# EAGLE schematic EEZ DIB MCU r3B4 (EAGLE 7.2.0)
SDcard socket updated
Assembly variants: Farnell, TME

## Sheet 1 of 5: I/O connectors, Encoder, user SW
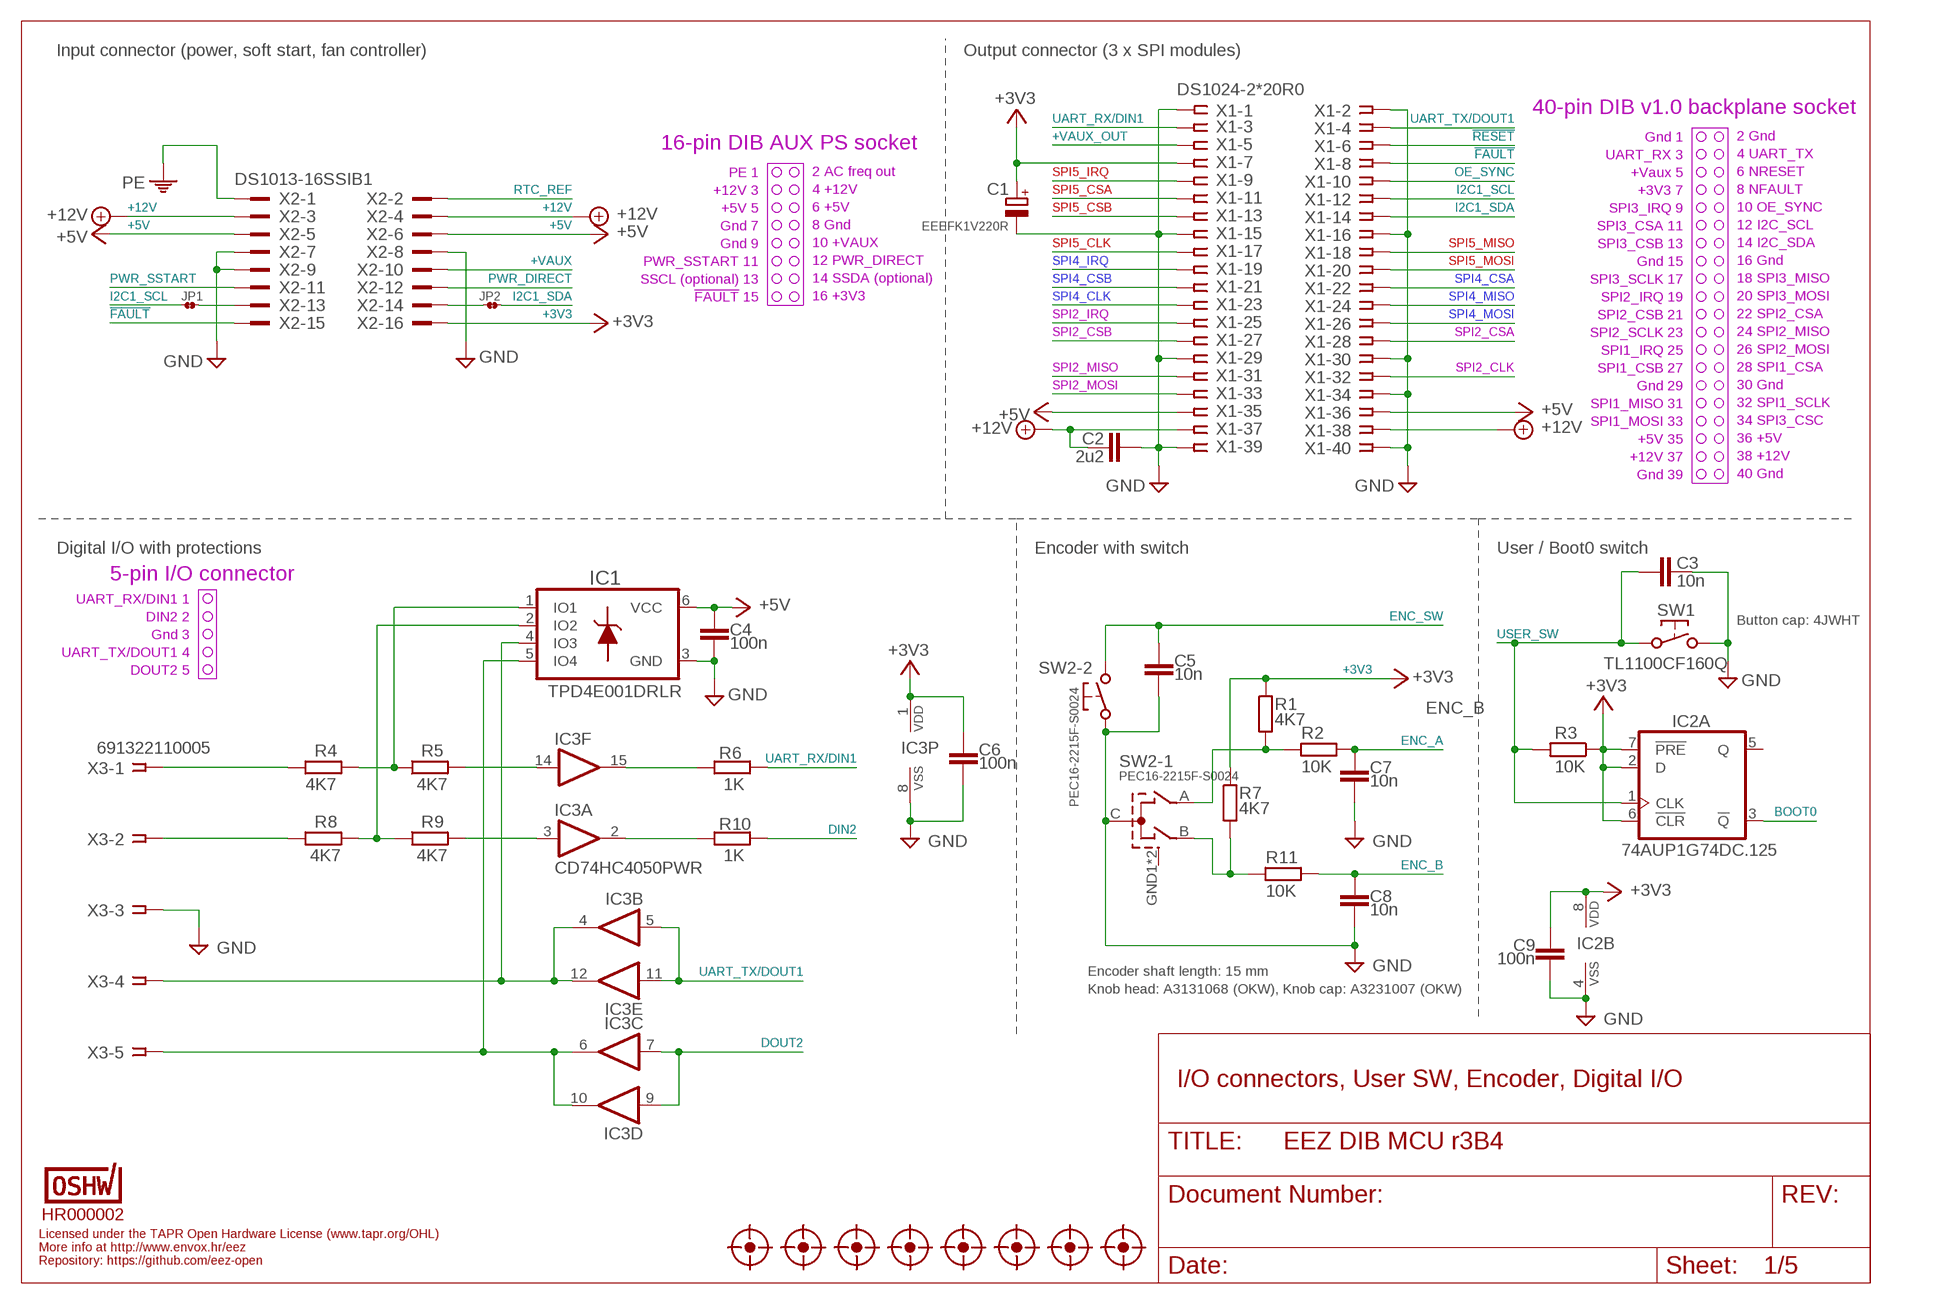
[diagram p0: schematic, sheet 1]

### Parts
C1  EEEFK1V220R  ECAPPANASONIC_C  [PANASONIC_C]
C2  2u2  C-EUC0805  [C0805]
C3  10n  C-EUC0805  [C0805]
C4  100n  C-EUC0603  [C0603]
C5  10n  C-EUC0805  [C0805]
C6  100n  C-EUC0603  [C0603]
C7  10n  C-EUC0805  [C0805]
C8  10n  C-EUC0805  [C0805]
C9  100n  C-EUC0603  [C0603]
FM1  FIDUCIAL  [FIDUCIAL]
FM2  FIDUCIAL  [FIDUCIAL]
FM3  FIDUCIAL  [FIDUCIAL]
FM4  FIDUCIAL  [FIDUCIAL]
FM5  FIDUCIAL  [FIDUCIAL]
FM6  FIDUCIAL  [FIDUCIAL]
FM7  FIDUCIAL  [FIDUCIAL]
FM8  FIDUCIAL  [FIDUCIAL]
IC1  TPD4E001DRLR  TPD4E001-DRL  [DRL6]
IC2  74AUP1G74DC.125  SN74LVC1G74DCTR-VSSOP  [DCU8]
IC3  CD74HC4050PWR  [PW16]
JP1  JP2-NOCUT  [JP2-NOCUT]
JP2  JP2-NOCUT  [JP2-NOCUT]
LABEL1  HR000002  OSHWA-CERT-SMALL  [CERT-SMALL-SILK]
R1  4K7  R-EU_R0805  [R0805]
R2  10K  R-EU_R0805  [R0805]
R3  10K  R-EU_R0805  [R0805]
R4  4K7  R-EU_R0805  [R0805]
R5  4K7  R-EU_R0805  [R0805]
R6  1K  R-EU_R0805  [R0805]
R7  4K7  R-EU_R0805  [R0805]
R8  4K7  R-EU_R0805  [R0805]
R9  4K7  R-EU_R0805  [R0805]
R10  1K  R-EU_R0805  [R0805]
R11  10K  R-EU_R0805  [R0805]
SW1  TL1100CF160Q  TL1100C  [TL1100C]
SW2  PEC16-2215F-S0024  ENCODER_SW-PEC16  [PEC16-2215F]
X1  DS1024-2*20R0  ZL263-40DG  [ZL263-40DG]
X2  DS1013-16SSIB1  IDC-16PIN  [IDC-16PIN]
X3  691322110005  MC1,5/5-G-3,5  [MC1,5/5-G-3,5]

### Nets
!FAULT: X1.8 X2.15 ; also sheet 2
!RESET: X1.6 ; also sheet 2,3,5
+3V3: C1.1(+) C6.1 C9.1 IC2.2(A:D) IC2.6(A:!CLR) IC2.7(A:!PRE) IC2.8(B:VDD) IC3.1(P:VDD) R1.1 R3.1 R7.1 X1.7 X2.16 ; also sheet 2,3,4,5
+5V: C4.1 IC1.6(VCC) X1.35 X1.36 X2.5 X2.6 ; also sheet 2,4
+12V: C2.1 X1.37 X1.38 X2.3 X2.4
+VAUX: X2.10 ; also sheet 2
+VAUX_OUT: X1.5 ; also sheet 2
BOOT0: IC2.3(A:!Q) ; also sheet 2
DIN2: R10.2 ; also sheet 2
DOUT2: IC3.7(C:I) IC3.9(D:I) ; also sheet 2
ENC_A: C7.2 R2.1 ; also sheet 2
ENC_B: C8.1 R11.1 ; also sheet 2
ENC_SW: C5.2 SW2.E ; also sheet 2
EOUT_A: R1.2 R2.2 SW2.A(-1:A)
EOUT_B: R7.2 R11.2 SW2.B(-1:B)
GND [gnd]: C1.2(-) C2.2 C3.1 C4.2 C5.1 C6.2 C7.1 C8.2 C9.2 IC1.3(GND) IC2.4(B:VSS) IC3.8(P:VSS) SW1.2 SW2.C(-1:C) SW2.D X1.1 X1.2 X1.15 X1.16 X1.29 X1.30 X1.34 X1.39 X1.40 X2.7 X2.8 X2.9 X3.3 ; also sheet 2,3,4,5
I2C1_SCL: JP1.1 X1.12 ; also sheet 2,3,4
I2C1_SDA: JP2.2 X1.14 ; also sheet 2,3,4
N$7: JP1.2 X2.13
N$13: JP2.1 X2.14
N$41: IC1.2(IO2) R8.2 R9.1
N$42: IC3.15(F:O) R6.1
N$43: IC3.2(A:O) R10.1
N$46: IC3.14(F:I) R5.2
N$47: IC3.3(A:I) R9.2
N$60: R4.1 X3.1
OE_SYNC: X1.10 ; also sheet 2
PE: X2.1 ; also sheet 4,5
PWR_DIRECT: X2.12 ; also sheet 2
PWR_SSTART: X2.11 ; also sheet 2
RTC_REF: X2.2 ; also sheet 2
SPI2_CLK: X1.32 ; also sheet 2
SPI2_CSA: X1.28 ; also sheet 2
SPI2_CSB: X1.27 ; also sheet 2
SPI2_IRQ: X1.25 ; also sheet 2
SPI2_MISO: X1.31 ; also sheet 2
SPI2_MOSI: X1.33 ; also sheet 2
SPI4_CLK: X1.23 ; also sheet 2
SPI4_CSA: X1.22 ; also sheet 2
SPI4_CSB: X1.21 ; also sheet 2
SPI4_IRQ: X1.19 ; also sheet 2
SPI4_MISO: X1.24 ; also sheet 2
SPI4_MOSI: X1.26 ; also sheet 2
SPI5_CLK: X1.17 ; also sheet 2
SPI5_CSA: X1.11 ; also sheet 2
SPI5_CSB: X1.13 ; also sheet 2
SPI5_IRQ: X1.9 ; also sheet 2
SPI5_MISO: X1.18 ; also sheet 2
SPI5_MOSI: X1.20 ; also sheet 2
UART_RX/DIN1: R6.2 X1.3 ; also sheet 2
UART_TX/DOUT1: IC3.5(B:I) IC3.11(E:I) X1.4 ; also sheet 2
USER_SW: C3.2 IC2.1(A:CLK) R3.2 SW1.1 ; also sheet 2
X_DIN1: IC1.1(IO1) R4.2 R5.1
X_DIN2: R8.1 X3.2
X_DOUT1: IC1.4(IO3) IC3.4(B:O) IC3.12(E:O) X3.4
X_DOUT2: IC1.5(IO4) IC3.6(C:O) IC3.10(D:O) X3.5
Unconnected: IC2.5(A:Q) SW2.GND1(-1:SH) SW2.GND2(-1:SH)

### Notes on the sheet
- Input connector (power, soft start, fan controller) | Output connector (3 x SPI modules)
- 40-pin DIB v1.0 backplane socket
- Gnd 1
- 2 Gnd
- 16-pin DIB AUX PS socket | UART_RX 3
- 4 UART_TX
- PE 1 | +Vaux 5
- 2 AC freq out | 6 NRESET
- +12V 3 | +3V3 7
- 4 +12V | 8 NFAULT
- +5V 5 | SPI3_IRQ 9
- 6 +5V | 10 OE_SYNC
- Gnd 7 | SPI3_CSA 11
- 8 Gnd | 12 I2C_SCL
- Gnd 9 | SPI3_CSB 13
- 10 +VAUX | 14 I2C_SDA
- PWR_SSTART 11 | Gnd 15
- 12 PWR_DIRECT | 16 Gnd
- SSCL (optional) 13 | SPI3_SCLK 17
- 14 SSDA (optional) | 18 SPI3_MISO
- !FAULT! 15 | SPI2_IRQ 19
- 16 +3V3 | 20 SPI3_MOSI
- SPI2_CSB 21
- 22 SPI2_CSA
- SPI2_SCLK 23
- 24 SPI2_MISO
- SPI1_IRQ 25
- 26 SPI2_MOSI
- SPI1_CSB 27
- 28 SPI1_CSA
- Gnd 29
- 30 Gnd
- SPI1_MISO 31
- 32 SPI1_SCLK
- SPI1_MOSI 33
- 34 SPI3_CSC
- +5V 35
- 36 +5V
- +12V 37
- 38 +12V
- Gnd 39
- 40 Gnd
- Digital I/O with protections | Encoder with switch | User / Boot0 switch
- 5-pin I/O connector
- UART_RX/DIN1 1
- DIN2 2
- Button cap: 4JWHT
- Gnd 3
- UART_TX/DOUT1 4
- DOUT2 5
- Encoder shaft length: 15 mm
- Knob head: A3131068 (OKW), Knob cap: A3231007 (OKW)
- I/O connectors, User SW, Encoder, Digital I/O
- Licensed under the TAPR Open Hardware License (www.tapr.org/OHL)
- More info at http://www.envox.hr/eez
- Repository: https://github.com/eez-open

## Sheet 2 of 5: STM32F7 MCU
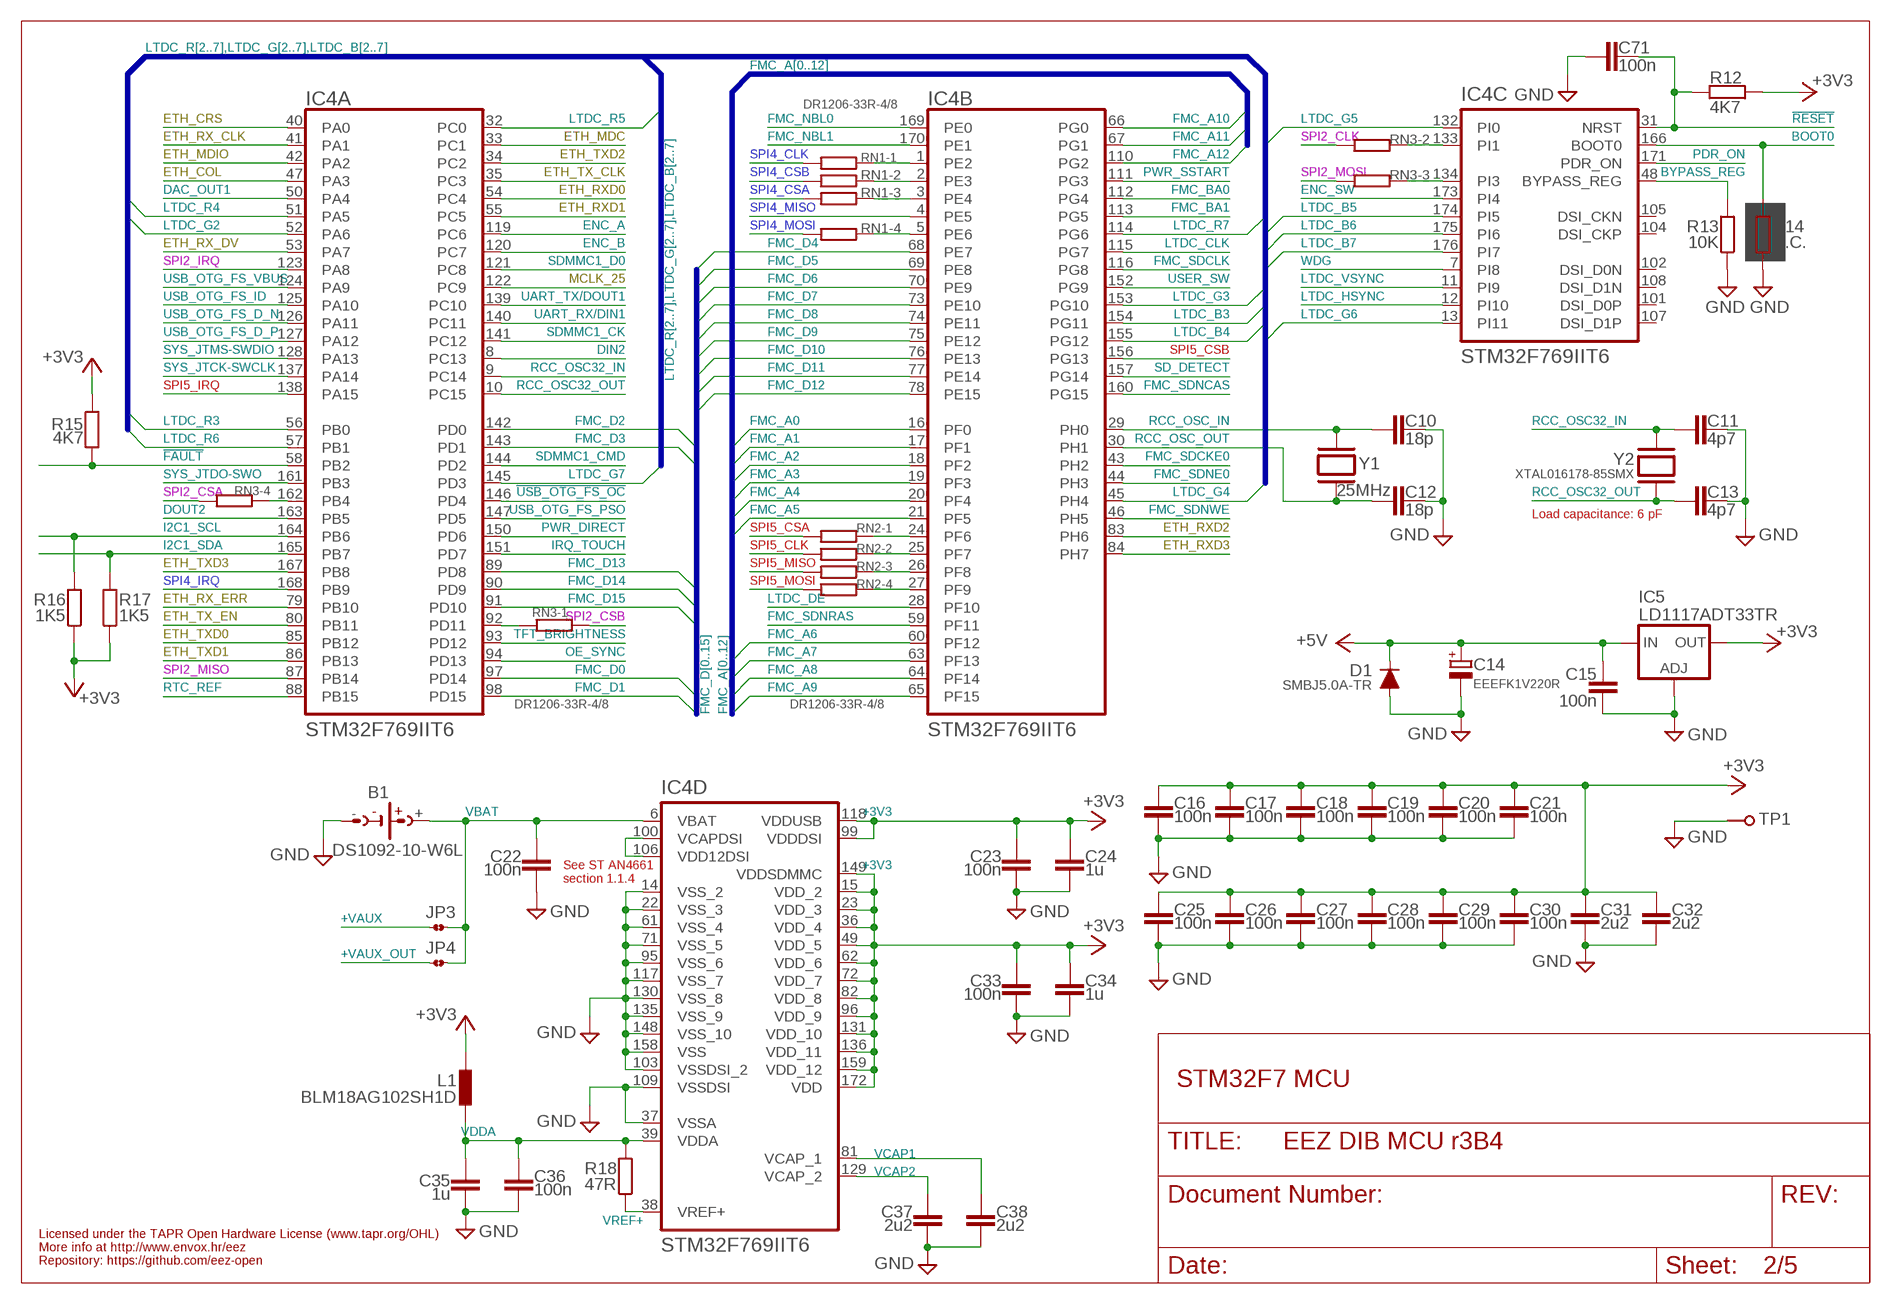
[diagram p1: schematic, sheet 2]

### Parts
B1  DS1092-10-W6L  CELL_BATTERY-SMT_HORIZ  [DS1092-10-W6L]
C10  18p  C-EUC0603  [C0603]
C11  4p7  C-EUC0603  [C0603]
C12  18p  C-EUC0603  [C0603]
C13  4p7  C-EUC0603  [C0603]
C14  EEEFK1V220R  ECAPPANASONIC_C  [PANASONIC_C]
C15  100n  C-EUC0603  [C0603]
C16  100n  C-EUC0603  [C0603]
C17  100n  C-EUC0603  [C0603]
C18  100n  C-EUC0603  [C0603]
C19  100n  C-EUC0603  [C0603]
C20  100n  C-EUC0603  [C0603]
C21  100n  C-EUC0603  [C0603]
C22  100n  C-EUC0603  [C0603]
C23  100n  C-EUC0603  [C0603]
C24  1u  C-EUC0805  [C0805]
C25  100n  C-EUC0603  [C0603]
C26  100n  C-EUC0603  [C0603]
C27  100n  C-EUC0603  [C0603]
C28  100n  C-EUC0603  [C0603]
C29  100n  C-EUC0603  [C0603]
C30  100n  C-EUC0603  [C0603]
C31  2u2  C-EUC0805  [C0805]
C32  2u2  C-EUC0805  [C0805]
C33  100n  C-EUC0603  [C0603]
C34  1u  C-EUC0805  [C0805]
C35  1u  C-EUC0805  [C0805]
C36  100n  C-EUC0603  [C0603]
C37  2u2  C-EUC0805  [C0805]
C38  2u2  C-EUC0805  [C0805]
C71  100n  C-EUC0603  [C0603]
D1  SMBJ5.0A-TR  DIODEDO214AA  [DO214AA]
IC4  STM32F769IIT6  STM32F769IXT  [LQFP-176_24X24MM]
IC5  LD1117ADT33TR  LD117ADT33TR  [DPACK]
JP3  JP2-CUT-0805  [R_0805]
JP4  JP2-CUT-0805  [R_0805]
L1  BLM18AG102SH1D  FERRITE_BEAD0603  [BEAD0603]
R12  4K7  R-EU_R0805  [R0805]
R13  10K  R-EU_R0805  [R0805]
R14  N.C.  R-EU_R0805  [R0805]
R15  4K7  R-EU_R0805  [R0805]
R16  1K5  R-EU_R0805  [R0805]
R17  1K5  R-EU_R0805  [R0805]
R18  47R  R-EU_R0805  [R0805]
RN1  DR1206-33R-4/8  R_ARRAY4  [CAY16]
RN2  DR1206-33R-4/8  R_ARRAY4  [CAY16]
RN3  DR1206-33R-4/8  R_ARRAY4  [CAY16]
TP1  PCB_TEST_TABSHIELD  [PCB_SHIELD_TAB]
Y1  25MHz  XTALSMD  [HC-49/4H]
Y2  XTAL016178-85SMX  XTAL85SMX  [85SMX]

### Nets
!FAULT: IC4.58(A:PB2) R15.2 ; also sheet 1
!RESET: C71.2 IC4.31(C:NRST) R12.2 ; also sheet 1,3,5
!USB_OTG_FS_OC: IC4.146(A:PD4) ; also sheet 4
+3V3: C16.1 C17.1 C18.1 C19.1 C20.1 C21.1 C23.1 C24.1 C25.1 C26.1 C27.1 C28.1 C29.1 C30.1 C31.1 C32.1 C33.1 C34.1 IC4.15(D:VDD_2) IC4.23(D:VDD_3) IC4.36(D:VDD_4) IC4.49(D:VDD_5) IC4.62(D:VDD_6) IC4.72(D:VDD_7) IC4.82(D:VDD_8) IC4.96(D:VDD_9) IC4.99(D:VDDDSI) IC4.118(D:VDDUSB) IC4.131(D:VDD_10) IC4.136(D:VDD_11) IC4.149(D:VDDSDMMC) IC4.159(D:VDD_12) IC4.172(D:VDD) IC5.4(OUT) L1.P$1 R12.1 R15.1 R16.1 R17.1 ; also sheet 1,3,4,5
+5V: C14.1(+) C15.1 D1.C IC5.3(IN) ; also sheet 1,4
+VAUX: JP3.2 ; also sheet 1
+VAUX_OUT: JP4.2 ; also sheet 1
BOOT0: IC4.166(C:BOOT0) R14.2 ; also sheet 1
BYPASS_REG: IC4.48(C:BYPASS_REG) R13.2
DAC_OUT1: IC4.50(A:PA4) ; also sheet 4
DIN2: IC4.8(A:PC13) ; also sheet 1
DOUT2: IC4.163(A:PB5) ; also sheet 1
ENC_A: IC4.119(A:PC6) ; also sheet 1
ENC_B: IC4.120(A:PC7) ; also sheet 1
ENC_SW: IC4.173(C:PI4) ; also sheet 1
ETH_COL: IC4.47(A:PA3) ; also sheet 5
ETH_CRS: IC4.40(A:PA0) ; also sheet 5
ETH_MDC: IC4.33(A:PC1) ; also sheet 5
ETH_MDIO: IC4.42(A:PA2) ; also sheet 5
ETH_RX_CLK: IC4.41(A:PA1) ; also sheet 5
ETH_RX_DV: IC4.53(A:PA7) ; also sheet 5
ETH_RX_ERR: IC4.79(A:PB10) ; also sheet 5
ETH_RXD0: IC4.54(A:PC4) ; also sheet 5
ETH_RXD1: IC4.55(A:PC5) ; also sheet 5
ETH_RXD2: IC4.83(B:PH6) ; also sheet 5
ETH_RXD3: IC4.84(B:PH7) ; also sheet 5
ETH_TX_CLK: IC4.35(A:PC3) ; also sheet 5
ETH_TX_EN: IC4.80(A:PB11) ; also sheet 5
ETH_TXD0: IC4.85(A:PB12) ; also sheet 5
ETH_TXD1: IC4.86(A:PB13) ; also sheet 5
ETH_TXD2: IC4.34(A:PC2) ; also sheet 5
ETH_TXD3: IC4.167(A:PB8) ; also sheet 5
FMC_A0: IC4.16(B:PF0) ; also sheet 3
FMC_A1: IC4.17(B:PF1) ; also sheet 3
FMC_A2: IC4.18(B:PF2) ; also sheet 3
FMC_A3: IC4.19(B:PF3) ; also sheet 3
FMC_A4: IC4.20(B:PF4) ; also sheet 3
FMC_A5: IC4.21(B:PF5) ; also sheet 3
FMC_A6: IC4.60(B:PF12) ; also sheet 3
FMC_A7: IC4.63(B:PF13) ; also sheet 3
FMC_A8: IC4.64(B:PF14) ; also sheet 3
FMC_A9: IC4.65(B:PF15) ; also sheet 3
FMC_A10: IC4.66(B:PG0) ; also sheet 3
FMC_A11: IC4.67(B:PG1) ; also sheet 3
FMC_A12: IC4.110(B:PG2) ; also sheet 3
FMC_BA0: IC4.112(B:PG4) ; also sheet 3
FMC_BA1: IC4.113(B:PG5) ; also sheet 3
FMC_D0: IC4.97(A:PD14) ; also sheet 3
FMC_D1: IC4.98(A:PD15) ; also sheet 3
FMC_D2: IC4.142(A:PD0) ; also sheet 3
FMC_D3: IC4.143(A:PD1) ; also sheet 3
FMC_D4: IC4.68(B:PE7) ; also sheet 3
FMC_D5: IC4.69(B:PE8) ; also sheet 3
FMC_D6: IC4.70(B:PE9) ; also sheet 3
FMC_D7: IC4.73(B:PE10) ; also sheet 3
FMC_D8: IC4.74(B:PE11) ; also sheet 3
FMC_D9: IC4.75(B:PE12) ; also sheet 3
FMC_D10: IC4.76(B:PE13) ; also sheet 3
FMC_D11: IC4.77(B:PE14) ; also sheet 3
FMC_D12: IC4.78(B:PE15) ; also sheet 3
FMC_D13: IC4.89(A:PD8) ; also sheet 3
FMC_D14: IC4.90(A:PD9) ; also sheet 3
FMC_D15: IC4.91(A:PD10) ; also sheet 3
FMC_NBL0: IC4.169(B:PE0) ; also sheet 3
FMC_NBL1: IC4.170(B:PE1) ; also sheet 3
FMC_SDCKE0: IC4.43(B:PH2) ; also sheet 3
FMC_SDCLK: IC4.116(B:PG8) ; also sheet 3
FMC_SDNCAS: IC4.160(B:PG15) ; also sheet 3
FMC_SDNE0: IC4.44(B:PH3) ; also sheet 3
FMC_SDNRAS: IC4.59(B:PF11) ; also sheet 3
FMC_SDNWE: IC4.46(B:PH5) ; also sheet 3
GND [gnd]: B1.- C10.1 C11.2 C12.1 C13.2 C14.2(-) C15.2 C16.2 C17.2 C18.2 C19.2 C20.2 C21.2 C22.2 C23.2 C24.2 C25.2 C26.2 C27.2 C28.2 C29.2 C30.2 C31.2 C32.2 C33.2 C34.2 C35.2 C36.2 C37.2 C38.2 C71.1 D1.A IC4.14(D:VSS_2) IC4.22(D:VSS_3) IC4.37(D:VSSA) IC4.61(D:VSS_4) IC4.71(D:VSS_5) IC4.95(D:VSS_6) IC4.103(D:VSSDSI_2) IC4.109(D:VSSDSI) IC4.117(D:VSS_7) IC4.130(D:VSS_8) IC4.135(D:VSS_9) IC4.148(D:VSS_10) IC4.158(D:VSS) IC5.1(ADJ) R13.1 R14.1 TP1.1 ; also sheet 1,3,4,5
I2C1_SCL: IC4.164(A:PB6) R16.2 ; also sheet 1,3,4
I2C1_SDA: IC4.165(A:PB7) R17.2 ; also sheet 1,3,4
IRQ_TOUCH: IC4.151(A:PD7) ; also sheet 4
LTDC_B3: IC4.154(B:PG11) ; also sheet 4
LTDC_B4: IC4.155(B:PG12) ; also sheet 4
LTDC_B5: IC4.174(C:PI5) ; also sheet 4
LTDC_B6: IC4.175(C:PI6) ; also sheet 4
LTDC_B7: IC4.176(C:PI7) ; also sheet 4
LTDC_CLK: IC4.115(B:PG7) ; also sheet 4
LTDC_DE: IC4.28(B:PF10) ; also sheet 4
LTDC_G2: IC4.52(A:PA6) ; also sheet 4
LTDC_G3: IC4.153(B:PG10) ; also sheet 4
LTDC_G4: IC4.45(B:PH4) ; also sheet 4
LTDC_G5: IC4.132(C:PI0) ; also sheet 4
LTDC_G6: IC4.13(C:PI11) ; also sheet 4
LTDC_G7: IC4.145(A:PD3) ; also sheet 4
LTDC_HSYNC: IC4.12(C:PI10) ; also sheet 4
LTDC_R3: IC4.56(A:PB0) ; also sheet 4
LTDC_R4: IC4.51(A:PA5) ; also sheet 4
LTDC_R5: IC4.32(A:PC0) ; also sheet 4
LTDC_R6: IC4.57(A:PB1) ; also sheet 4
LTDC_R7: IC4.114(B:PG6) ; also sheet 4
LTDC_VSYNC: IC4.11(C:PI9) ; also sheet 4
MCLK_25: IC4.122(A:PC9) ; also sheet 5
N$6: IC4.24(B:PF6) RN2.8
N$14: IC4.25(B:PF7) RN2.7
N$39: IC4.26(B:PF8) RN2.6
N$40: IC4.27(B:PF9) RN2.5
N$44: IC4.1(B:PE2) RN1.8
N$45: IC4.2(B:PE3) RN1.7
N$48: IC4.3(B:PE4) RN1.6
N$49: IC4.5(B:PE6) RN1.5
N$50: IC4.92(A:PD11) RN3.8
N$52: IC4.162(A:PB4) RN3.5
N$53: IC4.133(C:PI1) RN3.7
N$54: IC4.134(C:PI3) RN3.6
N$178: IC4.100(D:VCAPDSI) IC4.106(D:VDD12DSI)
OE_SYNC: IC4.94(A:PD13) ; also sheet 1
PDR_ON: IC4.171(C:PDR_ON) ; also sheet 3
PWR_DIRECT: IC4.150(A:PD6) ; also sheet 1
PWR_SSTART: IC4.111(B:PG3) ; also sheet 1
RCC_OSC32_IN: C11.1 IC4.9(A:PC14) Y2.1
RCC_OSC32_OUT: C13.1 IC4.10(A:PC15) Y2.4
RCC_OSC_IN: C10.2 IC4.29(B:PH0) Y1.2
RCC_OSC_OUT: C12.2 IC4.30(B:PH1) Y1.1
RTC_REF: IC4.88(A:PB15) ; also sheet 1
SD_DETECT: IC4.157(B:PG14) ; also sheet 3
SDMMC1_CK: IC4.141(A:PC12) ; also sheet 3
SDMMC1_CMD: IC4.144(A:PD2) ; also sheet 3
SDMMC1_D0: IC4.121(A:PC8) ; also sheet 3
SPI2_CLK: RN3.2 ; also sheet 1
SPI2_CSA: RN3.4 ; also sheet 1
SPI2_CSB: RN3.1 ; also sheet 1
SPI2_IRQ: IC4.123(A:PA8) ; also sheet 1
SPI2_MISO: IC4.87(A:PB14) ; also sheet 1
SPI2_MOSI: RN3.3 ; also sheet 1
SPI4_CLK: RN1.1 ; also sheet 1
SPI4_CSA: RN1.3 ; also sheet 1
SPI4_CSB: RN1.2 ; also sheet 1
SPI4_IRQ: IC4.168(A:PB9) ; also sheet 1
SPI4_MISO: IC4.4(B:PE5) ; also sheet 1
SPI4_MOSI: RN1.4 ; also sheet 1
SPI5_CLK: RN2.2 ; also sheet 1
SPI5_CSA: RN2.1 ; also sheet 1
SPI5_CSB: IC4.156(B:PG13) ; also sheet 1
SPI5_IRQ: IC4.138(A:PA15) ; also sheet 1
SPI5_MISO: RN2.3 ; also sheet 1
SPI5_MOSI: RN2.4 ; also sheet 1
SYS_JTCK-SWCLK: IC4.137(A:PA14) ; also sheet 3
SYS_JTDO-SWO: IC4.161(A:PB3) ; also sheet 3
SYS_JTMS-SWDIO: IC4.128(A:PA13) ; also sheet 3
TFT_BRIGHTNESS: IC4.93(A:PD12) ; also sheet 4
UART_RX/DIN1: IC4.140(A:PC11) ; also sheet 1
UART_TX/DOUT1: IC4.139(A:PC10) ; also sheet 1
USB_OTG_FS_D_N [diff]: IC4.126(A:PA11) ; also sheet 4
USB_OTG_FS_D_P [diff]: IC4.127(A:PA12) ; also sheet 4
USB_OTG_FS_ID: IC4.125(A:PA10) ; also sheet 4
USB_OTG_FS_PSO: IC4.147(A:PD5) ; also sheet 4
USB_OTG_FS_VBUS: IC4.124(A:PA9) ; also sheet 4
USER_SW: IC4.152(B:PG9) ; also sheet 1
VBAT: B1.+ C22.1 IC4.6(D:VBAT) JP3.1 JP4.1
VCAP1: C38.1 IC4.81(D:VCAP_1)
VCAP2: C37.1 IC4.129(D:VCAP_2)
VDDA: C35.1 C36.1 IC4.39(D:VDDA) L1.P$2 R18.2
VREF+: IC4.38(D:VREF+) R18.1
WDG: IC4.7(C:PI8) ; also sheet 3
Unconnected: IC4.101(C:DSI_D0P) IC4.102(C:DSI_D0N) IC4.104(C:DSI_CKP) IC4.105(C:DSI_CKN) IC4.107(C:DSI_D1P) IC4.108(C:DSI_D1N)

### Buses
FMC_A[0..12]
LTDC_R[2..7],LTDC_G[2..7],LTDC_B[2..7]
FMC_D[0..15]

### Notes on the sheet
- Load capacitance: 6 pF
- See ST AN4661
  section 1.1.4
- STM32F7 MCU
- Licensed under the TAPR Open Hardware License (www.tapr.org/OHL)
- More info at http://www.envox.hr/eez
- Repository: https://github.com/eez-open

## Sheet 3 of 5: SDRAM, JTAG, SD card, EEPROM
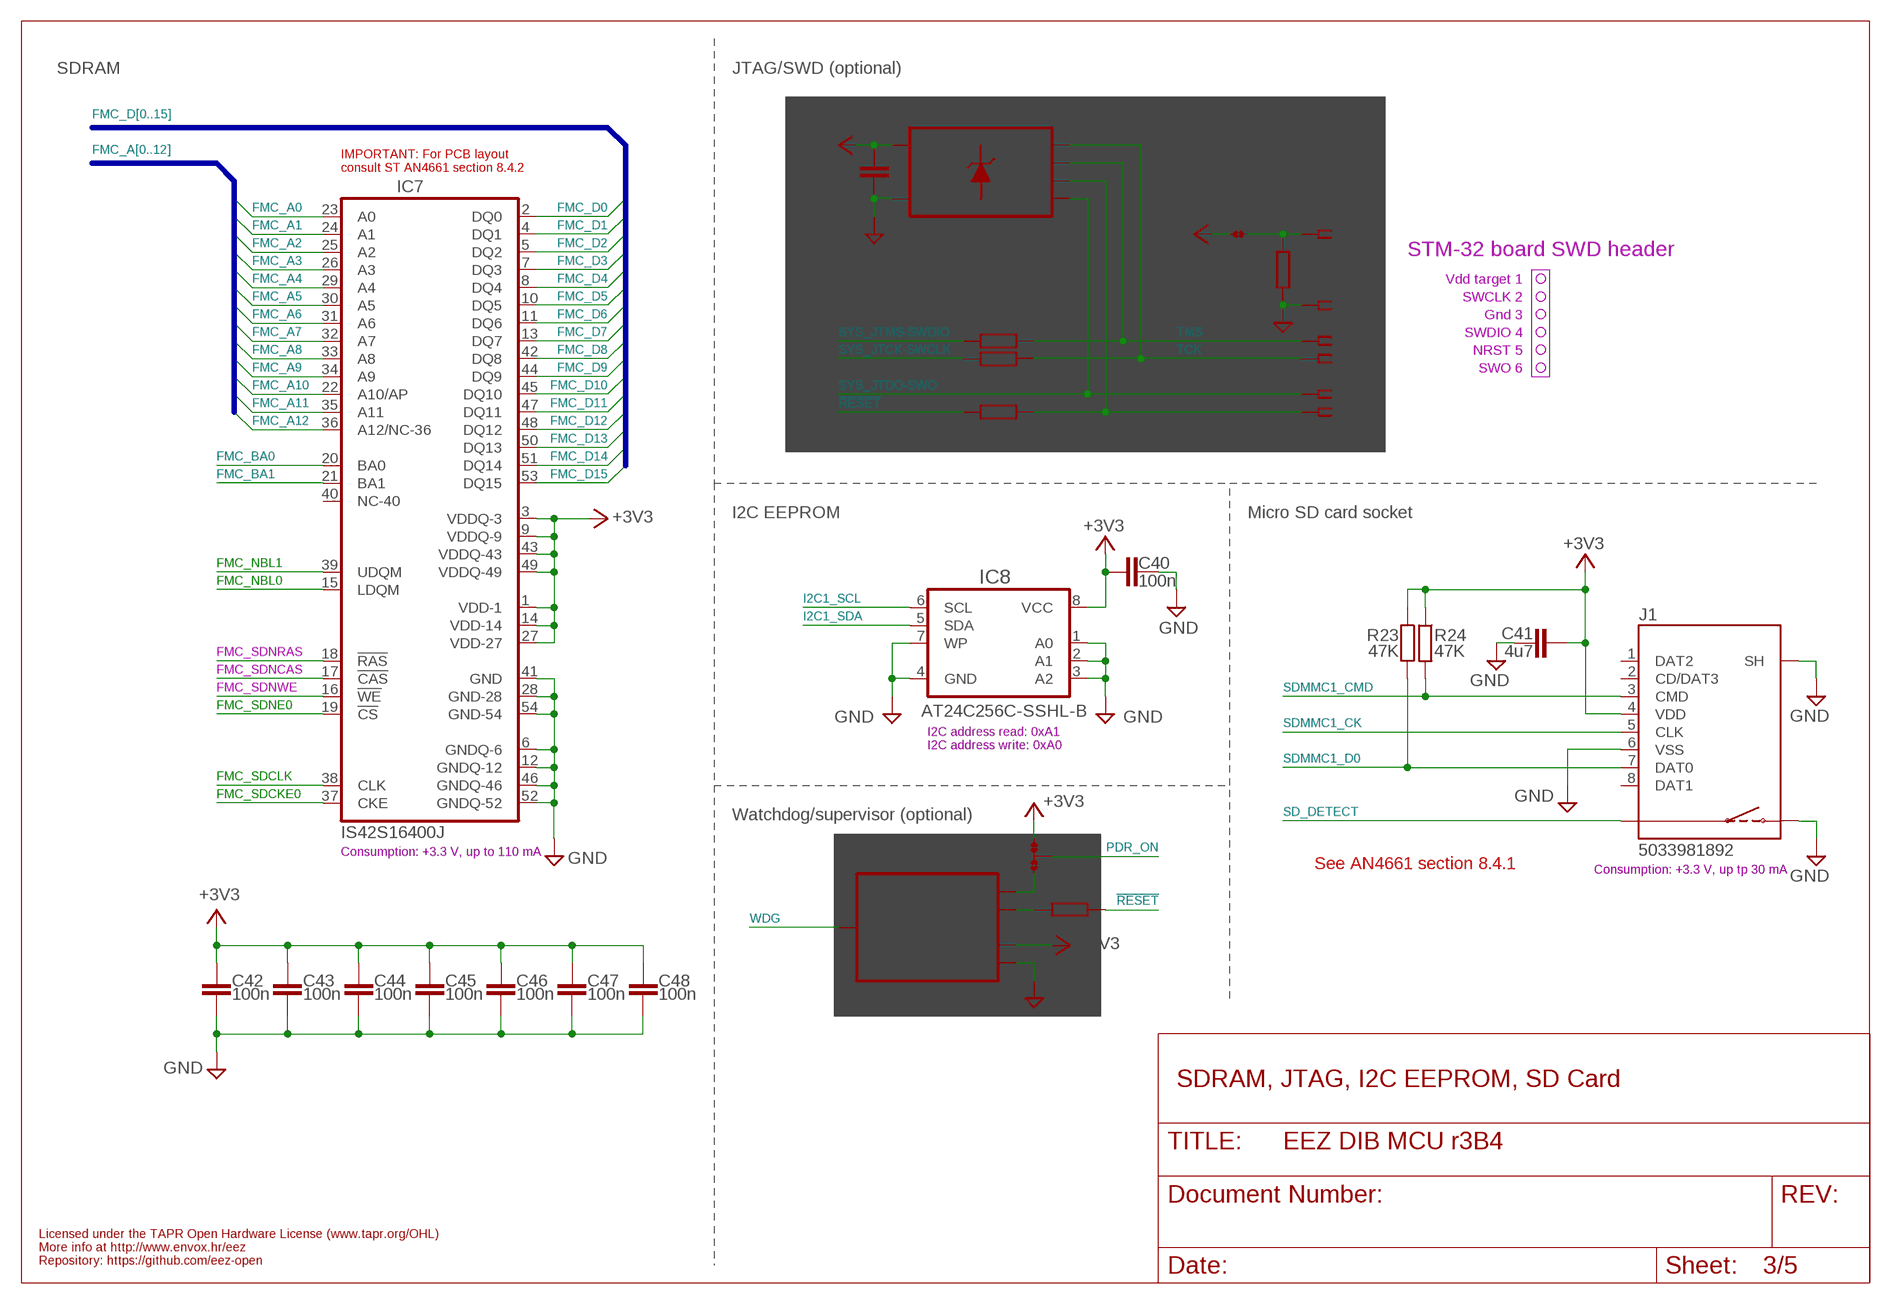
[diagram p2: schematic, sheet 3]

### Parts
C39  N.C.  C-EUC0603  [C0603]
C40  100n  C-EUC0603  [C0603]
C41  4u7  C-EUC1206  [C1206]
C42  100n  C-EUC0603  [C0603]
C43  100n  C-EUC0603  [C0603]
C44  100n  C-EUC0603  [C0603]
C45  100n  C-EUC0603  [C0603]
C46  100n  C-EUC0603  [C0603]
C47  100n  C-EUC0603  [C0603]
C48  100n  C-EUC0603  [C0603]
IC6  N.C.  TPD4E001-DRL  [DRL6]
IC7  IS42S16400J  IS42S16400  [TSOPII-54]
IC8  AT24C256C-SSHL-B  AT24CXXSOIC8  [SOIC127P600X173-8N]
IC9  N.C.  STM6824  [SOT23-5L_STM]
J1  5033981892  5033981892D&M  [5033981892-PCBA]
JP5  JP2-CUT  [JP2-CUT]
JP6  JP3-CUT-0805-ROTATED  [JP3-0805-CUT2]
R19  N.C.  R-EU_R0805  [R0805]
R20  N.C.  R-EU_R0805  [R0805]
R21  N.C.  R-EU_R0805  [R0805]
R22  N.C.  R-EU_R0805  [R0805]
R23  47K  R-EU_R0805  [R0805]
R24  47K  R-EU_R0805  [R0805]
R25  N.C.  R-EU_R0805  [R0805]
X4  N.C.  SSW-106-02-S-S  [SSW-106-02-S-S]

### Nets
!RESET: R22.1 R25.2 ; also sheet 1,2,5
+3V3: C39.1 C40.2 C41.1 C42.1 C43.1 C44.1 C45.1 C46.1 C47.1 C48.1 IC6.6(VCC) IC7.1(VDD-1) IC7.3(VDDQ-3) IC7.9(VDDQ-9) IC7.14(VDD-14) IC7.27(VDD-27) IC7.43(VDDQ-43) IC7.49(VDDQ-49) IC8.8(VCC) IC9.5(VCC) J1.4(VDD) JP5.1 JP6.NC R23.1 R24.1 ; also sheet 1,2,4,5
FMC_A0: IC7.23(A0) ; also sheet 2
FMC_A1: IC7.24(A1) ; also sheet 2
FMC_A2: IC7.25(A2) ; also sheet 2
FMC_A3: IC7.26(A3) ; also sheet 2
FMC_A4: IC7.29(A4) ; also sheet 2
FMC_A5: IC7.30(A5) ; also sheet 2
FMC_A6: IC7.31(A6) ; also sheet 2
FMC_A7: IC7.32(A7) ; also sheet 2
FMC_A8: IC7.33(A8) ; also sheet 2
FMC_A9: IC7.34(A9) ; also sheet 2
FMC_A10: IC7.22(A10/AP) ; also sheet 2
FMC_A11: IC7.35(A11) ; also sheet 2
FMC_A12: IC7.36(A12/NC-36) ; also sheet 2
FMC_BA0: IC7.20(BA0) ; also sheet 2
FMC_BA1: IC7.21(BA1) ; also sheet 2
FMC_D0: IC7.2(DQ0) ; also sheet 2
FMC_D1: IC7.4(DQ1) ; also sheet 2
FMC_D2: IC7.5(DQ2) ; also sheet 2
FMC_D3: IC7.7(DQ3) ; also sheet 2
FMC_D4: IC7.8(DQ4) ; also sheet 2
FMC_D5: IC7.10(DQ5) ; also sheet 2
FMC_D6: IC7.11(DQ6) ; also sheet 2
FMC_D7: IC7.13(DQ7) ; also sheet 2
FMC_D8: IC7.42(DQ8) ; also sheet 2
FMC_D9: IC7.44(DQ9) ; also sheet 2
FMC_D10: IC7.45(DQ10) ; also sheet 2
FMC_D11: IC7.47(DQ11) ; also sheet 2
FMC_D12: IC7.48(DQ12) ; also sheet 2
FMC_D13: IC7.50(DQ13) ; also sheet 2
FMC_D14: IC7.51(DQ14) ; also sheet 2
FMC_D15: IC7.53(DQ15) ; also sheet 2
FMC_NBL0: IC7.15(LDQM) ; also sheet 2
FMC_NBL1: IC7.39(UDQM) ; also sheet 2
FMC_SDCKE0: IC7.37(CKE) ; also sheet 2
FMC_SDCLK: IC7.38(CLK) ; also sheet 2
FMC_SDNCAS: IC7.17(!CAS) ; also sheet 2
FMC_SDNE0: IC7.19(!CS) ; also sheet 2
FMC_SDNRAS: IC7.18(!RAS) ; also sheet 2
FMC_SDNWE: IC7.16(!WE) ; also sheet 2
GND [gnd]: C39.2 C40.1 C41.2 C42.2 C43.2 C44.2 C45.2 C46.2 C47.2 C48.2 IC6.3(GND) IC7.6(GNDQ-6) IC7.12(GNDQ-12) IC7.28(GND-28) IC7.41(GND) IC7.46(GNDQ-46) IC7.52(GNDQ-52) IC7.54(GND-54) IC8.1(A0) IC8.2(A1) IC8.3(A2) IC8.4(GND) IC8.7(WP) IC9.2(VSS) J1.6(VSS) J1.S1(SH) J1.S2(SH) J1.S3(SH) J1.S(SH) J1.SW2 R19.1 X4.3 ; also sheet 1,2,4,5
I2C1_SCL: IC8.6(SCL) ; also sheet 1,2,4
I2C1_SDA: IC8.5(SDA) ; also sheet 1,2,4
N$51: JP5.2 R19.2 X4.1
N$58: IC9.3(RST) JP6.NO
N$59: IC9.1(!RST) R25.1
PDR_ON: JP6.COM ; also sheet 2
SD_DETECT: J1.SW1 ; also sheet 2
SDMMC1_CK: J1.5(CLK) ; also sheet 2
SDMMC1_CMD: J1.3(CMD) R24.2 ; also sheet 2
SDMMC1_D0: J1.7(DAT0) R23.2 ; also sheet 2
SWD_NRST: IC6.4(IO3) R22.2 X4.5
SYS_JTCK-SWCLK: R21.1 ; also sheet 2
SYS_JTDO-SWO: IC6.5(IO4) X4.6 ; also sheet 2
SYS_JTMS-SWDIO: R20.1 ; also sheet 2
TCK: IC6.1(IO1) R21.2 X4.2
TMS: IC6.2(IO2) R20.2 X4.4
WDG: IC9.4(WDI) ; also sheet 2
Unconnected: IC7.40(NC-40) J1.1(DAT2) J1.2(CD/DAT3) J1.8(DAT1)

### Buses
FMC_A[0..12]
FMC_D[0..15]

### Notes on the sheet
- SDRAM | JTAG/SWD (optional)
- IMPORTANT: For PCB layout 
  consult ST AN4661 section 8.4.2
- STM-32 board SWD header
- Vdd target 1
- SWCLK 2
- Gnd 3
- SWDIO 4
- NRST 5
- SWO 6
- I2C EEPROM | Micro SD card socket
- I2C address read: 0xA1
- I2C address write: 0xA0
- Watchdog/supervisor (optional)
- Consumption: +3.3 V, up to 110 mA
- See AN4661 section 8.4.1
- Consumption: +3.3 V, up tp 30 mA
- SDRAM, JTAG, I2C EEPROM, SD Card
- Licensed under the TAPR Open Hardware License (www.tapr.org/OHL)
- More info at http://www.envox.hr/eez
- Repository: https://github.com/eez-open

## Sheet 4 of 5: TFT LCD, Audio, USB
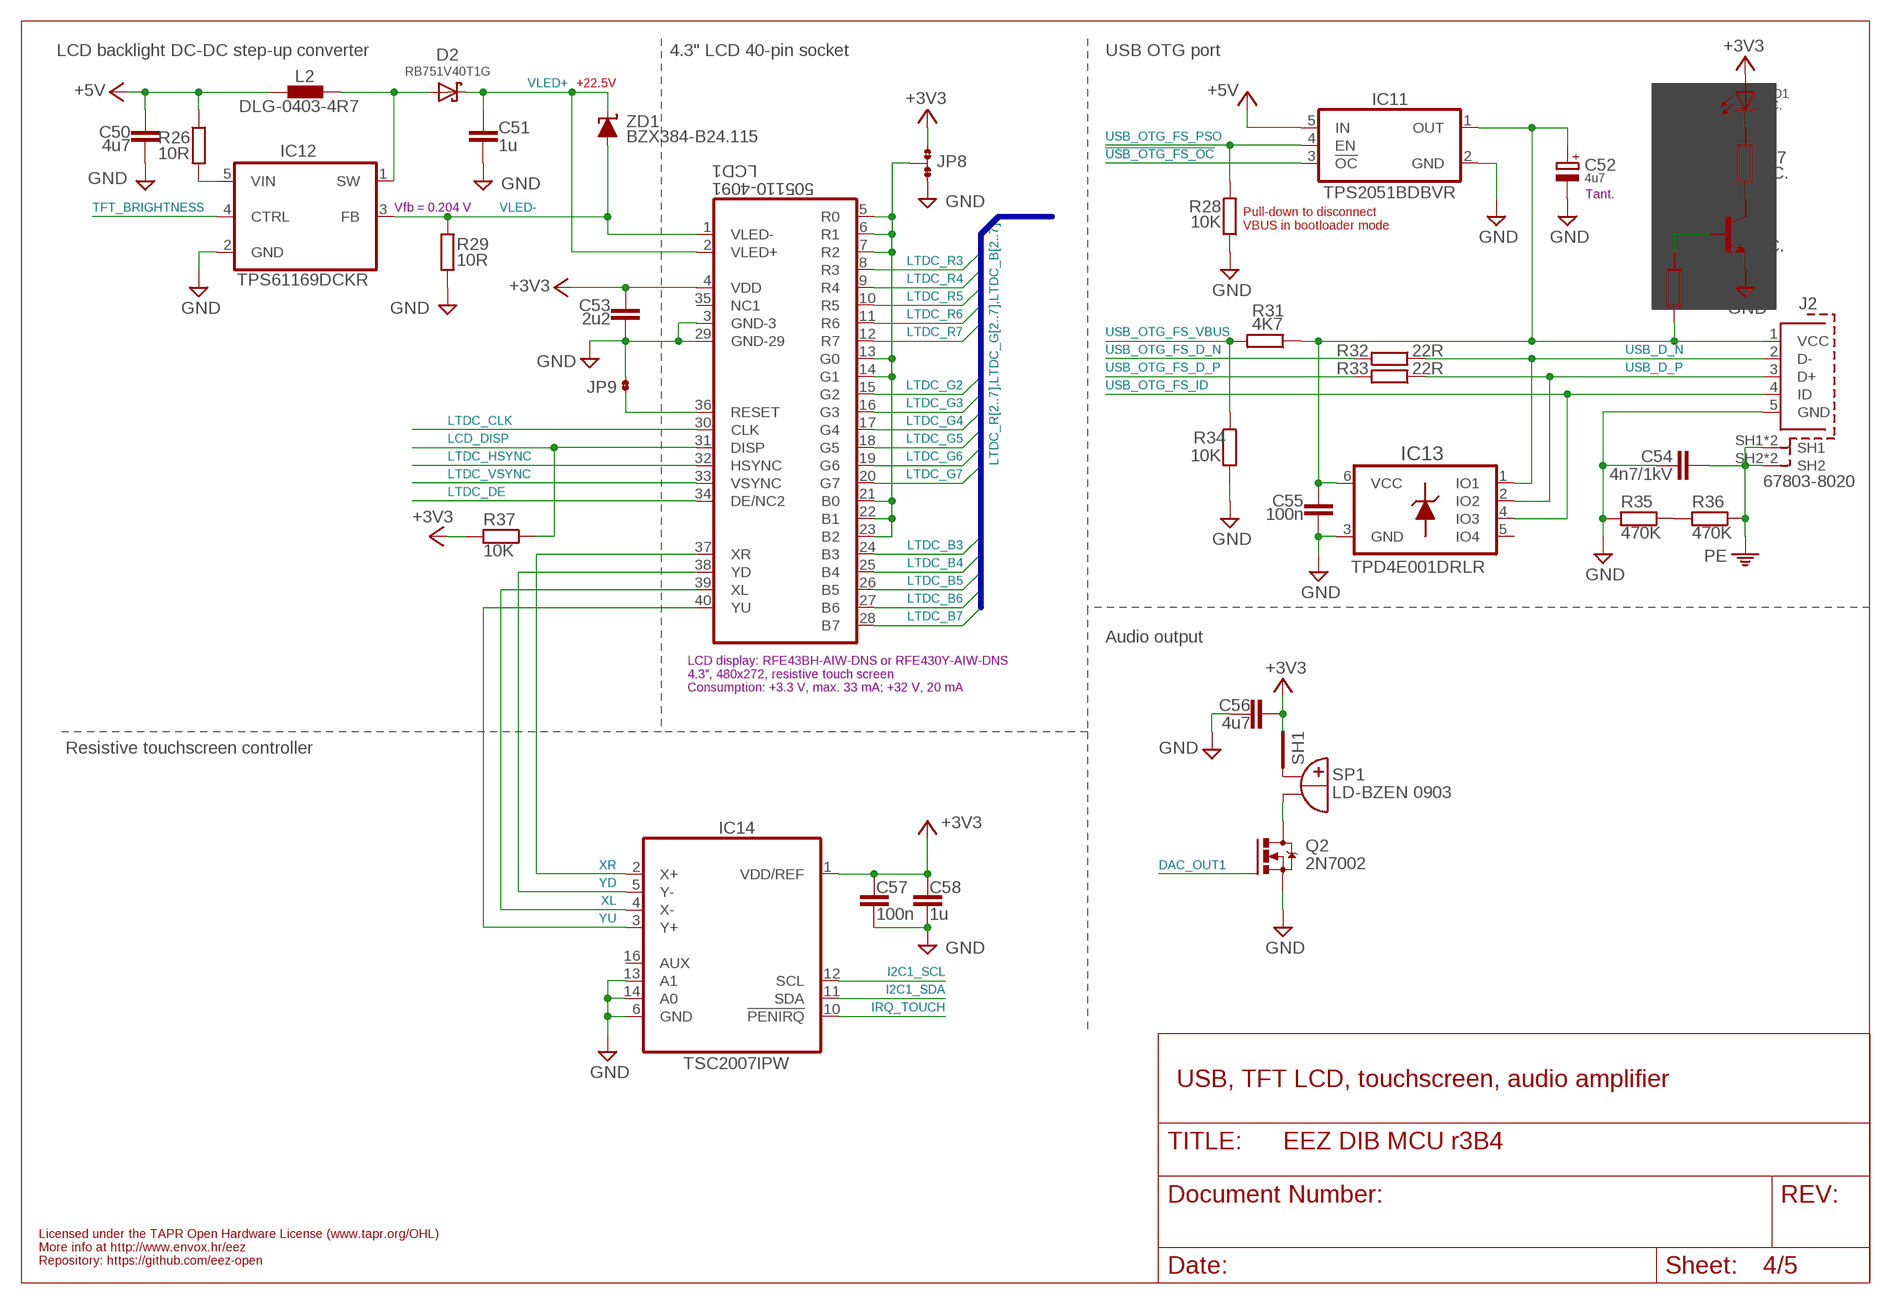
[diagram p3: schematic, sheet 4]

### Parts
C50  4u7  C-EUC1206  [C1206]
C51  1u  C-EUC0805  [C0805]
C52  4u7  ECAP1206  [EC1206]
C53  2u2  C-EUC0805  [C0805]
C54  4n7/1kV  C-EUC1812  [C1812]
C55  100n  C-EUC0603  [C0603]
C56  4u7  C-EUC1206  [C1206]
C57  100n  C-EUC0603  [C0603]
C58  1u  C-EUC0805  [C0805]
D2  RB751V40T1G  SCHOTTKYSOD-323R  [SOD323-R]
IC11  TPS2051BDBVR  TPS2051B  [DBV5]
IC12  TPS61169DCKR  [DCK5]
IC13  TPD4E001DRLR  TPD4E001-DRL  [DRL6]
IC14  TSC2007IPW  [PW(R-PDSO-G16)]
J2  67803-8020  678038020  [678038020]
JP8  JP3-CUT-0805-ROTATED  [JP3-0805-CUT2]
JP9  JP2-NOCUT-0805  [JP2-0805-NOCUT]
L2  DLG-0403-4R7  DE0403  [DE0403]
LCD1  505110-4091  RFE430Y-AIW-DNS  [FPC_40]
LED1  N.C.  LED0805  [LED_0805]
Q1  N.C.  MMBT5551LT1-NPN-SOT23-BEC  [SOT23-BEC]
Q2  2N7002  [SOT103P240X110-3N]
R26  10R  R-EU_R0805  [R0805]
R27  N.C.  R-EU_R0805  [R0805]
R28  10K  R-EU_R0805  [R0805]
R29  10R  R-EU_R0805  [R0805]
R30  N.C.  R-EU_R0805  [R0805]
R31  4K7  R-EU_R0805  [R0805]
R32  22R  R-EU_R0805  [R0805]
R33  22R  R-EU_R0805  [R0805]
R34  10K  R-EU_R0805  [R0805]
R35  470K  R-EU_R0805  [R0805]
R36  470K  R-EU_R0805  [R0805]
R37  10K  R-EU_R0805  [R0805]
SH1  SHORTNOHOLE  [SHORT_NOHOLE]
SP1  LD-BZEN 0903  LD-BZEN-COMBO  [LD-BZEN_COMBO]
ZD1  BZX384-B24.115  ZENER-DIODESOD323  [SOD323-W]

### Nets
!USB_OTG_FS_OC: IC11.3(!OC) ; also sheet 2
+3V3: C53.1 C56.2 C57.2 C58.2 IC14.1(VDD/REF) JP8.NO LCD1.4(VDD) LED1.A R37.2 SH1.P$2(GND_B) ; also sheet 1,2,3,5
+5V: C50.1 IC11.5(IN) L2.1 R26.1 ; also sheet 1,2
DAC_OUT1: Q2.1(G) ; also sheet 2
GND [gnd]: C50.2 C51.2 C52.- C53.2 C54.1 C55.1 C56.1 C57.1 C58.1 IC11.2(GND) IC12.2(GND) IC13.3(GND) IC14.6(GND) IC14.13(A1) IC14.14(A0) J2.5(GND) JP8.NC JP9.2 LCD1.3(GND-3) LCD1.29(GND-29) Q1.E Q2.2(S) R28.1 R29.2 R34.2 R35.2 ; also sheet 1,2,3,5
I2C1_SCL: IC14.12(SCL) ; also sheet 1,2,3
I2C1_SDA: IC14.11(SDA) ; also sheet 1,2,3
IRQ_TOUCH: IC14.10(!PENIRQ) ; also sheet 2
LCD_DISP: LCD1.31(DISP) R37.1
LTDC_B3: LCD1.24(B3) ; also sheet 2
LTDC_B4: LCD1.25(B4) ; also sheet 2
LTDC_B5: LCD1.26(B5) ; also sheet 2
LTDC_B6: LCD1.27(B6) ; also sheet 2
LTDC_B7: LCD1.28(B7) ; also sheet 2
LTDC_CLK: LCD1.30(CLK) ; also sheet 2
LTDC_DE: LCD1.34(DE/NC2) ; also sheet 2
LTDC_G2: LCD1.15(G2) ; also sheet 2
LTDC_G3: LCD1.16(G3) ; also sheet 2
LTDC_G4: LCD1.17(G4) ; also sheet 2
LTDC_G5: LCD1.18(G5) ; also sheet 2
LTDC_G6: LCD1.19(G6) ; also sheet 2
LTDC_G7: LCD1.20(G7) ; also sheet 2
LTDC_HSYNC: LCD1.32(HSYNC) ; also sheet 2
LTDC_R3: LCD1.8(R3) ; also sheet 2
LTDC_R4: LCD1.9(R4) ; also sheet 2
LTDC_R5: LCD1.10(R5) ; also sheet 2
LTDC_R6: LCD1.11(R6) ; also sheet 2
LTDC_R7: LCD1.12(R7) ; also sheet 2
LTDC_VSYNC: LCD1.33(VSYNC) ; also sheet 2
N$2: LED1.C R27.2
N$4 [gnd]: JP8.COM LCD1.5(R0) LCD1.6(R1) LCD1.7(R2) LCD1.13(G0) LCD1.14(G1) LCD1.21(B0) LCD1.22(B1) LCD1.23(B2)
N$5: Q2.3(D) SP1.- SP1.-B(-)
N$16: Q1.C R27.1
N$19: Q1.B R30.2
N$20: SH1.P$1(GND_A) SP1.+ SP1.+B(+)
N$24 [gnd]: JP9.1 LCD1.36(RESET)
N$30: IC12.5(VIN) R26.2
N$57: R35.1 R36.2
PE: C54.2 J2.SH1 J2.SH1.1(SH1) J2.SH2 J2.SH2.2(SH2) R36.1 ; also sheet 1,5
SW_WLED: D2.A IC12.1(SW) L2.2
TFT_BRIGHTNESS: IC12.4(CTRL) ; also sheet 2
USB_D_N [diff]: IC13.1(IO1) J2.2(D-) R32.1
USB_D_P [diff]: IC13.2(IO2) J2.3(D+) R33.1
USB_OTG_FS_D_N [diff]: R32.2 ; also sheet 2
USB_OTG_FS_D_P [diff]: R33.2 ; also sheet 2
USB_OTG_FS_ID: IC13.4(IO3) J2.4(ID) ; also sheet 2
USB_OTG_FS_PSO: IC11.4(EN) R28.2 ; also sheet 2
USB_OTG_FS_VBUS: R31.2 R34.1 ; also sheet 2
USB_VBUS: C52.+ C55.2 IC11.1(OUT) IC13.6(VCC) J2.1(VCC) R30.1 R31.1
VLED+: C51.1 D2.C LCD1.2(VLED+) ZD1.C
VLED-: IC12.3(FB) LCD1.1(VLED-) R29.1 ZD1.A
XL: IC14.4(X-) LCD1.39(XL)
XR: IC14.2(X+) LCD1.37(XR)
YD: IC14.5(Y-) LCD1.38(YD)
YU: IC14.3(Y+) LCD1.40(YU)
Unconnected: IC13.5(IO4) IC14.16(AUX) LCD1.35(NC1)

### Buses
LTDC_R[2..7],LTDC_G[2..7],LTDC_B[2..7]

### Notes on the sheet
- LCD backlight DC-DC step-up converter | 4.3" LCD 40-pin socket | USB OTG port
- +22.5V
- Tant.
- Vfb = 0.204 V
- Pull-down to disconnect
  VBUS in bootloader mode
- Audio output
- LCD display: RFE43BH-AIW-DNS or RFE430Y-AIW-DNS
  4.3", 480x272, resistive touch screen
- Consumption: +3.3 V, max. 33 mA; +32 V, 20 mA
- Resistive touchscreen controller
- USB, TFT LCD, touchscreen, audio amplifier
- Licensed under the TAPR Open Hardware License (www.tapr.org/OHL)
- More info at http://www.envox.hr/eez
- Repository: https://github.com/eez-open

## Sheet 5 of 5: Ethernet PHY
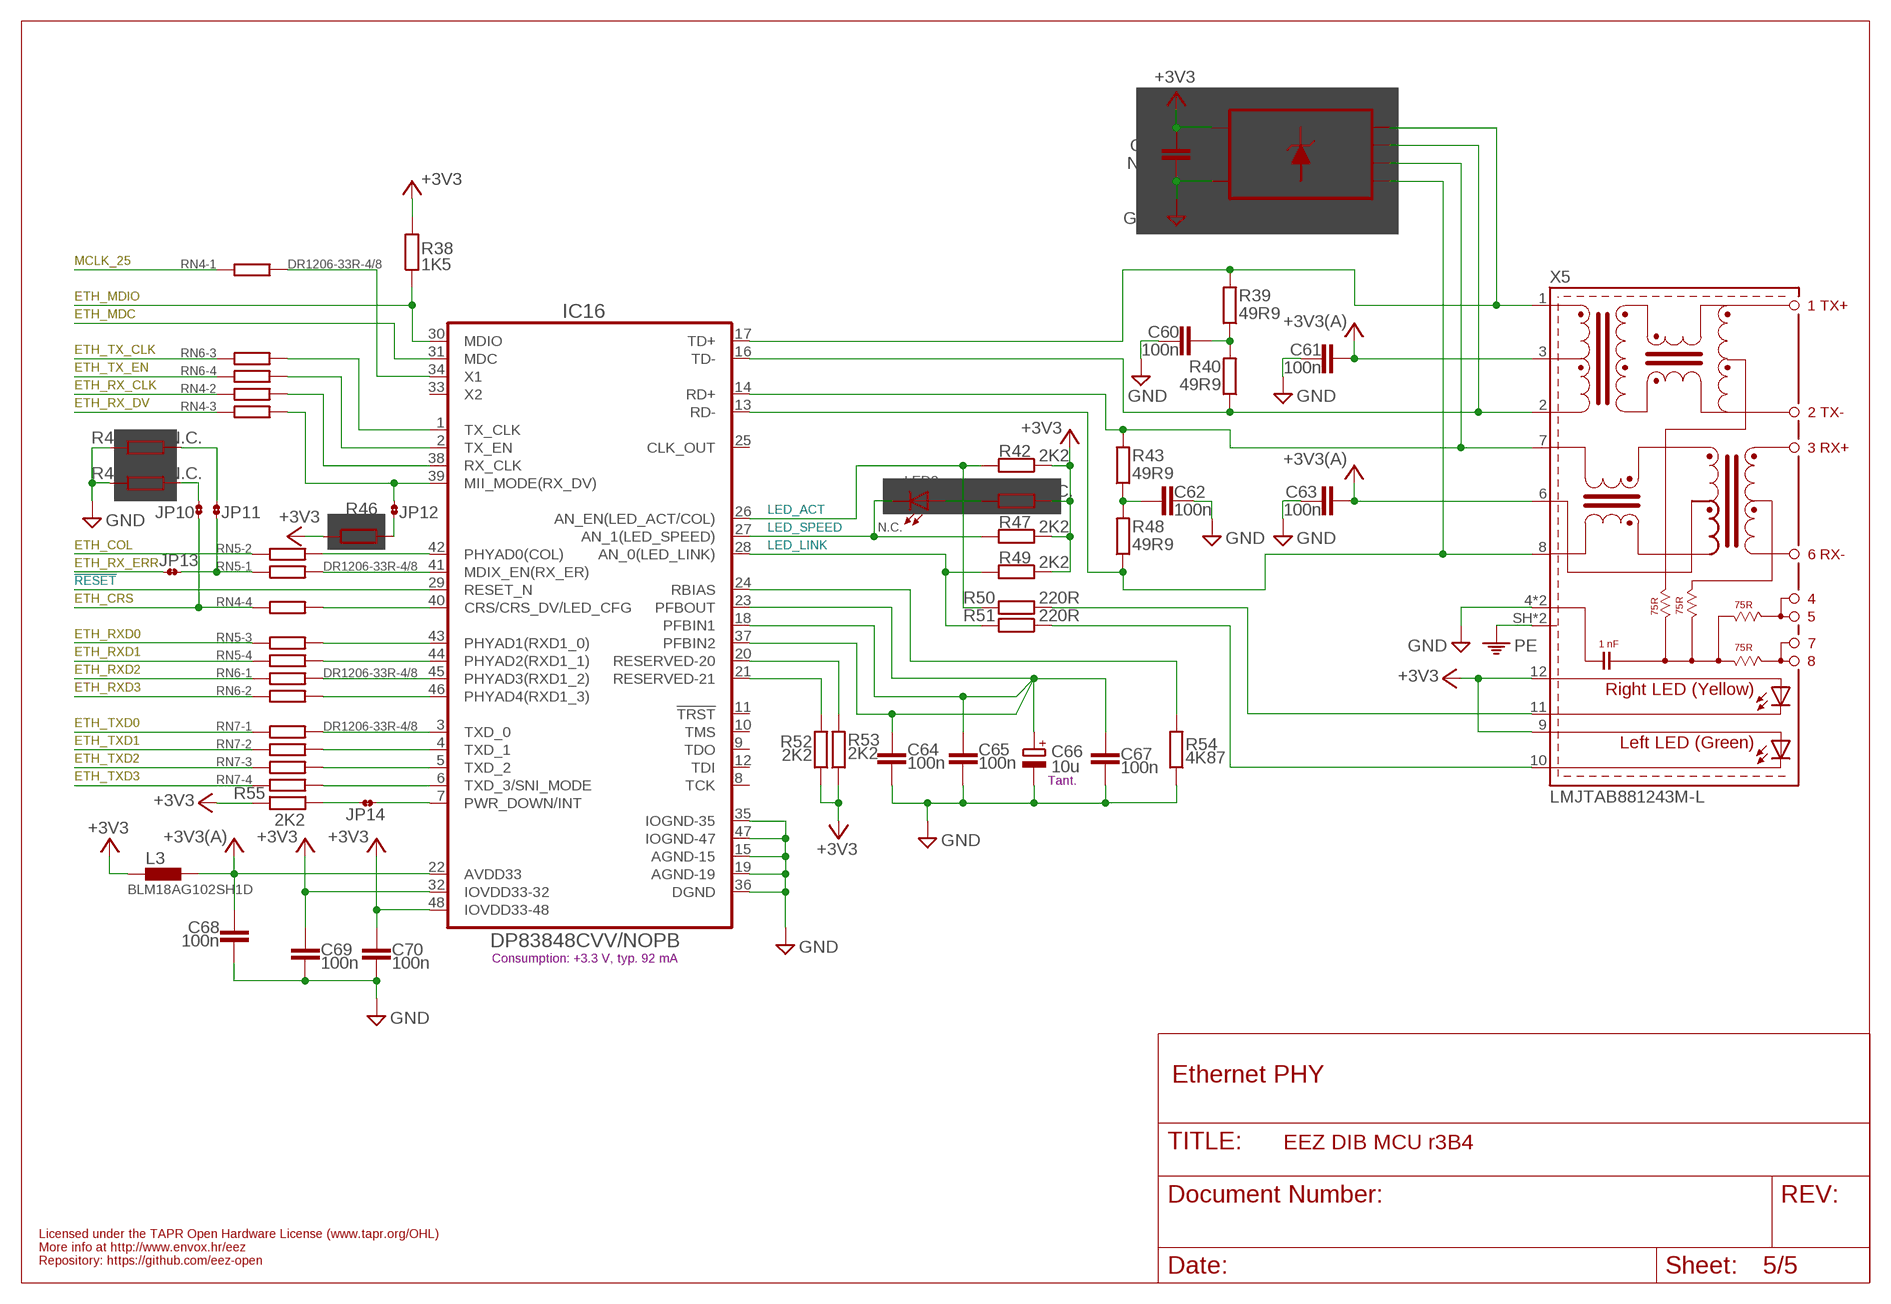
[diagram p4: schematic, sheet 5]

### Parts
C59  N.C.  C-EUC0603  [C0603]
C60  100n  C-EUC0603  [C0603]
C61  100n  C-EUC0603  [C0603]
C62  100n  C-EUC0603  [C0603]
C63  100n  C-EUC0603  [C0603]
C64  100n  C-EUC0603  [C0603]
C65  100n  C-EUC0603  [C0603]
C66  10u  ECAP1206  [EC1206]
C67  100n  C-EUC0603  [C0603]
C68  100n  C-EUC0603  [C0603]
C69  100n  C-EUC0603  [C0603]
C70  100n  C-EUC0603  [C0603]
IC15  N.C.  TPD4E001-DRL  [DRL6]
IC16  DP83848CVV/NOPB  [PT48]
JP10  JP2-CUT  [JP2-CUT]
JP11  JP2-CUT  [JP2-CUT]
JP12  JP2-CUT  [JP2-CUT]
JP13  JP2-NOCUT  [JP2-NOCUT]
JP14  JP2-NOCUT  [JP2-NOCUT]
L3  BLM18AG102SH1D  FERRITE_BEAD0603  [BEAD0603]
LED2  N.C.  LED0805  [LED_0805]
R38  1K5  R-EU_R0805  [R0805]
R39  49R9  R-EU_R0805  [R0805]
R40  49R9  R-EU_R0805  [R0805]
R41  N.C.  R-EU_R0805  [R0805]
R42  2K2  R-EU_R0805  [R0805]
R43  49R9  R-EU_R0805  [R0805]
R44  N.C.  R-EU_R0805  [R0805]
R45  N.C.  R-EU_R0805  [R0805]
R46  N.C.  R-EU_R0805  [R0805]
R47  2K2  R-EU_R0805  [R0805]
R48  49R9  R-EU_R0805  [R0805]
R49  2K2  R-EU_R0805  [R0805]
R50  220R  R-EU_R0805  [R0805]
R51  220R  R-EU_R0805  [R0805]
R52  2K2  R-EU_R0805  [R0805]
R53  2K2  R-EU_R0805  [R0805]
R54  4K87  R-EU_R0805  [R0805]
R55  2K2  R-EU_R0805  [R0805]
RN4  DR1206-33R-4/8  R_ARRAY4  [CAY16]
RN5  DR1206-33R-4/8  R_ARRAY4  [CAY16]
RN6  DR1206-33R-4/8  R_ARRAY4  [CAY16]
RN7  DR1206-33R-4/8  R_ARRAY4  [CAY16]
X5  LMJTAB881243M-L  RJ45-TRAFO-LED  [RJ45-TRAFO-LED]

### Nets
!RESET: IC16.29(RESET_N) ; also sheet 1,2,3
+3V3: C59.1 C69.1 C70.1 IC15.6(VCC) IC16.32(IOVDD33-32) IC16.48(IOVDD33-48) L3.P$1 R38.2 R42.1 R45.1 R46.1 R47.1 R49.1 R52.1 R53.1 R55.1 X5.9(GREEN-A) X5.12(YELLOW_A) ; also sheet 1,2,3,4
+3V3(A): C61.2 C63.2 C68.1 IC16.22(AVDD33) L3.P$2 X5.3(CT) X5.6(CR)
ETH_COL: RN5.2 ; also sheet 2
ETH_CRS: JP10.1 RN4.4 ; also sheet 2
ETH_MDC: IC16.31(MDC) ; also sheet 2
ETH_MDIO: IC16.30(MDIO) R38.1 ; also sheet 2
ETH_RX_CLK: RN4.2 ; also sheet 2
ETH_RX_DV: RN4.3 ; also sheet 2
ETH_RX_ER: JP11.1 JP13.1 RN5.1
ETH_RX_ERR: JP13.2 ; also sheet 2
ETH_RXD0: RN5.3 ; also sheet 2
ETH_RXD1: RN5.4 ; also sheet 2
ETH_RXD2: RN6.1 ; also sheet 2
ETH_RXD3: RN6.2 ; also sheet 2
ETH_TX_CLK: RN6.3 ; also sheet 2
ETH_TX_EN: RN6.4 ; also sheet 2
ETH_TXD0: RN7.1 ; also sheet 2
ETH_TXD1: RN7.2 ; also sheet 2
ETH_TXD2: RN7.3 ; also sheet 2
ETH_TXD3: RN7.4 ; also sheet 2
GND [gnd]: C59.2 C60.2 C61.1 C62.2 C63.1 C64.2 C65.2 C66.- C67.2 C68.2 C69.2 C70.2 IC15.3(GND) IC16.15(AGND-15) IC16.19(AGND-19) IC16.35(IOGND-35) IC16.36(DGND) IC16.47(IOGND-47) R41.1 R44.1 R54.1 X5.4(GND) X5.5(GND) ; also sheet 1,2,3,4
LED_ACT: IC16.26(AN_EN(LED_ACT/COL)) R42.2 R50.2
LED_LINK: IC16.28(AN_0(LED_LINK)) R49.2 R51.2
LED_SPEED: IC16.27(AN_1(LED_SPEED)) LED2.C R47.2
MCLK_25: RN4.1 ; also sheet 2
N$1: IC16.1(TX_CLK) RN6.6
N$3: C60.1 R39.1 R40.2
N$8: R50.1 X5.11(YELLOW-C)
N$9: R51.1 X5.10(GREEN-C)
N$10: IC16.2(TX_EN) RN6.5
N$11: IC16.39(MII_MODE(RX_DV)) JP12.2 RN4.6
N$12: IC16.38(RX_CLK) RN4.7
N$15: IC16.3(TXD_0) RN7.8
N$17: IC16.4(TXD_1) RN7.7
N$21: IC16.5(TXD_2) RN7.6
N$22: IC16.34(X1) RN4.8
N$23: JP12.1 R46.2
N$25: JP10.2 R44.2
N$26: JP11.2 R41.2
N$27: IC16.7(PWR_DOWN/INT) JP14.2
N$28: JP14.1 R55.2
N$29: IC16.6(TXD_3/SNI_MODE) RN7.5
N$31: IC16.46(PHYAD4(RXD1_3)) RN6.7
N$32: IC16.45(PHYAD3(RXD1_2)) RN6.8
N$33: IC16.42(PHYAD0(COL)) RN5.7
N$34: IC16.44(PHYAD2(RXD1_1)) RN5.5
N$35: IC16.43(PHYAD1(RXD1_0)) RN5.6
N$36: IC16.41(MDIX_EN(RX_ER)) RN5.8
N$37: IC16.40(CRS/CRS_DV/LED_CFG) RN4.5
N$97: IC16.24(RBIAS) R54.2
N$98: IC16.21(RESERVED-21) R52.2
N$99: IC16.20(RESERVED-20) R53.2
N$101: LED2.A R45.2
N$102: C62.1 R43.1 R48.2
PE: X5.SH X5.SH2(SH) ; also sheet 1,4
PFBOUT: C64.1 C65.1 C66.+ C67.1 IC16.18(PFBIN1) IC16.23(PFBOUT) IC16.37(PFBIN2)
RD+: IC15.4(IO3) IC16.14(RD+) R43.2 X5.7(RD+)
RD-: IC15.5(IO4) IC16.13(RD-) R48.1 X5.8(RD-)
TD+: IC15.1(IO1) IC16.17(TD+) R39.2 X5.1(TD+)
TD-: IC15.2(IO2) IC16.16(TD-) R40.1 X5.2(TD-)
Unconnected: IC16.8(TCK) IC16.9(TDO) IC16.10(TMS) IC16.11(!TRST) IC16.12(TDI) IC16.25(CLK_OUT) IC16.33(X2)

### Notes on the sheet
- Tant.
- Consumption: +3.3 V, typ. 92 mA
- Ethernet PHY
- Licensed under the TAPR Open Hardware License (www.tapr.org/OHL)
- More info at http://www.envox.hr/eez
- Repository: https://github.com/eez-open

## Library data of the parts
B1 = EEZ_connectors:CELL_BATTERY: HARWIN Battery holder for coin cell 20mm Farnell: 2115304
C1 C14 C52 C66 = EEZ_Lib1:ECAP
C2-C13 C15-C48 C50 C51 C53-C65 C67-C71 = rcl:C-EU: CAPACITOR, European symbol
D1 = MyLib6:DIODE
D2 = EEZ_Lib1:SCHOTTKY
FM1-FM8 = EEZ_Lib1:FIDUCIAL: Fiducial mark for pick and place automation
IC1 IC6 IC13 IC15 = EEZ_Lib1:TPD4E001: Low-Capacitance 4-Channel ESD-Protection for High-Speed Data Interfaces
IC2 = EEZ_Lib1:SN74LVC1G74DCTR: Single Positive-Edge-Triggered D-Type Flip-Flop with Clear and Preset
IC3 = EEZ_DIB:CD74HC4050: High-Speed CMOS Logic Hex Buffers, Non-Inverting; MANUFACTURER_PART_NUMBER: CD74HC4050PWR; VENDOR: Vendor
IC4 = EEZ_DIB:STM32F769IXT
IC5 = v-reg:LD117A?*: Low drop fixed and adjustable positive voltage regulators 1 A Source: http://www.st.com/stonline/products/literature/ds/7194/ld1117axx.pdf
IC7 = EEZ_Lib1:IS42S16400: 1 MBits x 16 Bits x 4 Banks (64-Mbit) Synchronous Dynamic RAM
IC8 = EEZ_Lib1:AT24CXX: I2C-Compatible (2-wire) Serial EEPROM
IC9 = EEZ_DIB:STM6824: 5-pin supervisor with watchdog timer and push-button reset
IC11 = EEZ_Lib1:TPS2051B: Current-Limited, Power-Distribution Switch (pos. enable input)
IC12 = EEZ_Lib1:TPS61169DCKR: 38-V High Current-Boost WLED Driver with PWM Control; MANUFACTURER: Texas Instruments; PARTNUMBER: TPS61169DCKR; REFDES: RefDes; TYPE: TYPE; VALUE: Value
IC14 = EEZ_Lib1:TSC2007: 12-Bit, Nanopower, 4-Wire Micro TOUCH SCREEN CONTROLLER with I2C Interface
IC16 = EEZ_Lib1:DP83848: DP83848C/I/VYB/YB PHYTER™ QFP Single Port 10/100 Mb/s Ethernet Physical Layer Transceiver
J1 = EEZ_Lib1:5033981892: SD Micro connector; push-push; SMT; gold plated
J2 = EEZ_Lib1:678038020: USB AB mini socket; SMT; PIN:5; horizontal; gold plated
JP1 JP2 JP9 JP13 JP14 = EEZ_Lib1:JP2-NOCUT
JP3-JP5 JP10-JP12 = EEZ_Lib1:JP2-CUT
JP6 JP8 = EEZ_Lib1:JP3-CUT
L1 L3 = EEZ_Lib1:FERRITE_BEAD: FAIR-RITE - 2506033007Y3 - FERRITE BEAD, 0.04OHM, 3A, 0603 Farnell: 2112873
L2 = EEZ_Lib1:DE0403: Ferrocore SMD power coil 4.0 x 4.5 mm
LABEL1 = EEZ_Lib1:OSHWA-CERT
LCD1 = EEZ_Lib1:RFE430Y-AIW-DNS: 40-pin socket for TFT LCD display with touchscreen
LED1 LED2 = EEZ_Lib1:LED
Q1 = transistor:*-NPN-: NPN Transistror BF959 corrected 2008.03.06
Q2 = EEZ_Lib1:2N7002: N-CHANNEL ENHANCEMENT MODE FIELD EFFECT TRANSISTOR; MPN: 2N7002-7-F; OC_FARNELL: 1713823; OC_NEWARK: 25R5679; PACKAGE: SOT-23-3; SUPPLIER: DIODES INC.
R1-R55 = rcl:R-EU_: RESISTOR, European symbol
RN1-RN7 = EEZ_Lib1:R_ARRAY4: 1206 four resistor array
SH1 = EEZ_Lib1:SHORT
SP1 = EEZ_Lib1:LD-BZEN: Loudity LD-BZEN-xxxx Sound transducer: electromagnetic; without built-in generator
SW1 = EEZ_switches:TL1100C: Tactile Switch 12 X 6.45MM Right angle
SW2 = EEZ_switches:ENCODER_SW
TP1 = EEZ_Lib1:PCB_TEST_TAB
X1 = EEZ_connectors:ZL263-40DG: Socket; pin strips; female; PIN:40; angled 90°; 2.54mm; THT; 2x20
X2 = EEZ_connectors:IDC-16PIN: 16-pin IDC socket
X3 = EEZ_connectors:MC1,5/5-G-3,5: Pluggable Terminal Blocks 5-pin 3.5mm pitch Through Hole Header
X4 = con-samtec:SSW-106-02-S-S: THROUGH-HOLE .025" SQ POST SOCKET Source: Samtec SSW.pdf; MPN: SSW-106-02-S-S; OC_FARNELL: unknown; OC_NEWARK: 11P9416
X5 = EEZ_Lib1:RJ45-TRAFO-LED: AMPHENOL LMJTAB881243M-L Socket; RJ45; PIN:8; shielded, with LED and trafo; TME: LMJTAB881243M-L
Y1 Y2 = EEZ_Lib1:XTAL
ZD1 = EEZ_Lib1:ZENER-DIODE

## Net classes
0 default: width 0.152 mm, drill 0.3 mm, clearance 0.203 mm
1 diff: width 0.229 mm, drill 0.3 mm, clearance 0.203 mm
2 gnd: width 0.152 mm, drill 0.3 mm, clearance 0.203 mm